# Altium schematic sheet 51-2001-01-5_04 Power Module Schematic.SchDoc
size 431 x 279 mm; Organization: ORGANIZATION; Address1: ADDRESS 1; Address2: ADDRESS 2; Address3: ADDRESS 3; Address4: ADDRESS 4; Revision: -; SheetNumber: 4; SheetTotal: 4; ENG_APP_DATE: --/--/--; DSN_APP_DATE: --/--/--; CHK_APP_DATE: --/--/--
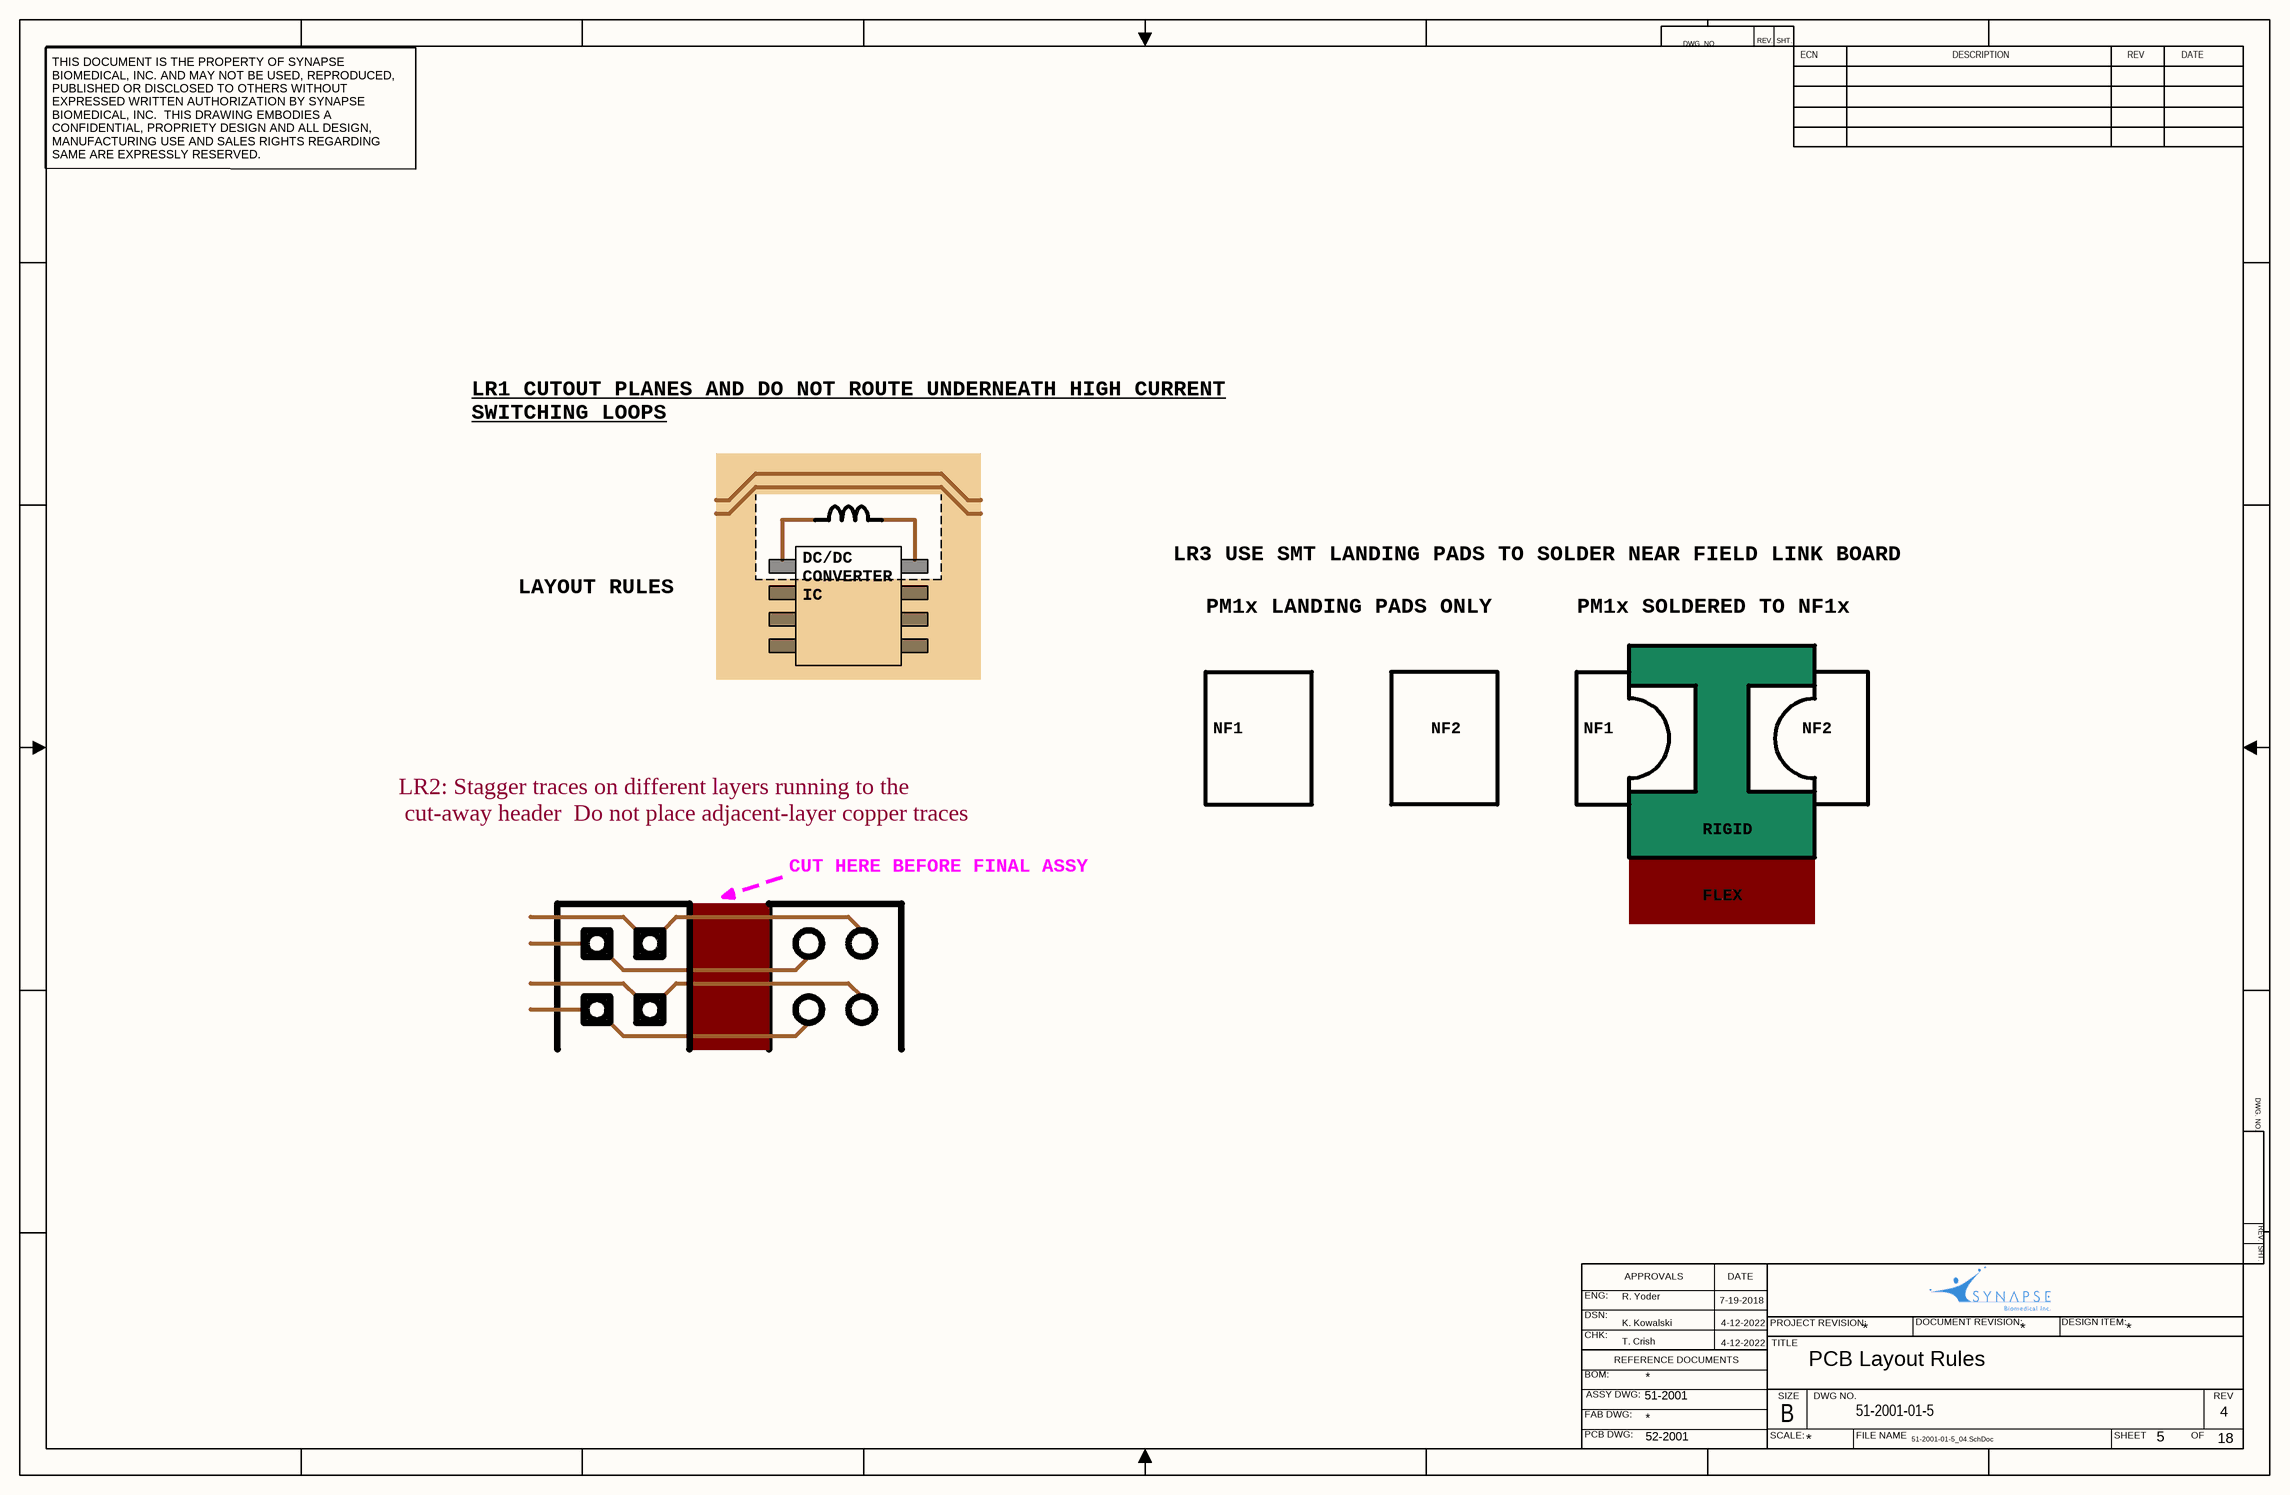
[diagram p0: 51-2001-01-5_04 Power Module Schematic.SchDoc]

## Notes on the sheet
- DWG. NO.
- REV.
- SHT.
- ECN
- DESCRIPTION
- REV
- DATE
- THIS DOCUMENT IS THE PROPERTY OF SYNAPSE BIOMEDICAL, INC. AND MAY NOT BE USED, REPRODUCED, PUBLISHED OR DISCLOSED TO OTHERS WITHOUT EXPRESSED WRITTEN AUTHORIZATION BY SYNAPSE BIOMEDICAL, INC.  THIS DRAWING EMBODIES A CONFIDENTIAL, PROPRIETY DESIGN AND ALL DESIGN, MANUFACTURING USE AND SALES RIGHTS REGARDING SAME ARE EXPRESSLY RESERVED.
- LR1 CUTOUT PLANES AND DO NOT ROUTE UNDERNEATH HIGH CURRENT SWITCHING LOOPS
- LR3 USE SMT LANDING PADS TO SOLDER NEAR FIELD LINK BOARD
- LAYOUT RULES
- DC/DC CONVERTER IC
- PM1x LANDING PADS ONLY
- PM1x SOLDERED TO NF1x
- NF1
- NF2
- LR2: Stagger traces on different layers running to the
  cut-away header  Do not place adjacent-layer copper traces
- RIGID
- CUT HERE BEFORE FINAL ASSY
- FLEX
- ENG:
- R. Yoder
- APPROVALS
- 7-19-2018
- DSN:
- CHK:
- REFERENCE DOCUMENTS
- K. Kowalski
- T. Crish
- 4-12-2022
- PROJECT REVISION:
- TITLE
- PCB Layout Rules
- *
- DOCUMENT REVISION:
- DESIGN ITEM:
- BOM:
- FAB DWG:
- PCB DWG:
- ASSY DWG:
- 51-2001
- SCALE:
- SIZE
- B
- DWG NO.
- 51-2001-01-5
- FILE NAME
- SHEET
- OF
- 4
- 52-2001
- 51-2001-01-5_04.SchDoc
- 5
- 18